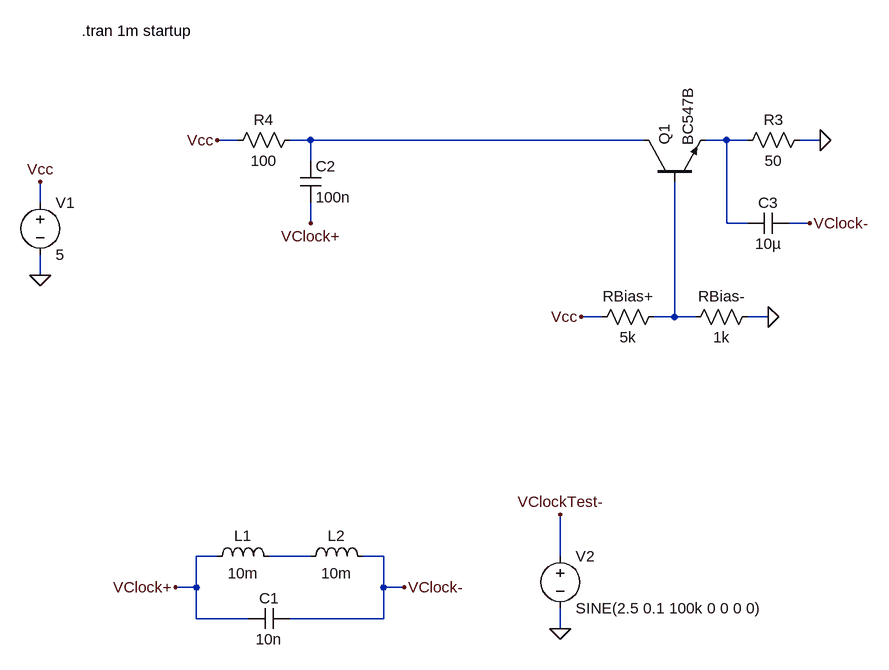
[diagram p0: schematic amplifier_test2.asc]
amplifier_test2.asc, the LTspice schematic file:
Version 4
SHEET 1 880 912
WIRE -224 128 -256 128
WIRE -112 128 -144 128
WIRE 400 128 -112 128
WIRE 528 128 496 128
WIRE 560 128 528 128
WIRE 672 128 640 128
WIRE -112 160 -112 128
WIRE -528 224 -528 192
WIRE -112 256 -112 224
WIRE 528 256 528 128
WIRE 560 256 528 256
WIRE 656 256 624 256
WIRE -528 336 -528 304
WIRE 336 400 304 400
WIRE 448 400 448 192
WIRE 448 400 416 400
WIRE 480 400 448 400
WIRE 592 400 560 400
WIRE -256 768 -288 768
WIRE -112 768 -176 768
WIRE 0 768 -32 768
WIRE 272 768 272 704
WIRE -288 816 -288 768
WIRE -288 816 -320 816
WIRE 0 816 0 768
WIRE 32 816 0 816
WIRE -288 864 -288 816
WIRE -208 864 -288 864
WIRE 0 864 0 816
WIRE 0 864 -144 864
WIRE 272 880 272 848
FLAG -528 336 0
FLAG -528 192 Vcc
FLAG -256 128 Vcc
FLAG 304 400 Vcc
FLAG 672 128 0
FLAG 592 400 0
FLAG 32 816 VClock-
FLAG -320 816 VClock+
FLAG 656 256 VClock-
FLAG -112 256 VClock+
FLAG 272 880 0
FLAG 272 704 VClockTest-
SYMBOL npn 400 192 R270
SYMATTR InstName Q1
SYMATTR Value BC547B
SYMBOL cap -208 880 R270
WINDOW 0 32 32 VTop 2
WINDOW 3 0 32 VBottom 2
SYMATTR InstName C1
SYMATTR Value 10n
SYMBOL ind -272 784 R270
WINDOW 0 32 56 VTop 2
WINDOW 3 5 56 VBottom 2
SYMATTR InstName L1
SYMATTR Value 10m
SYMBOL ind -128 784 R270
WINDOW 0 32 56 VTop 2
WINDOW 3 5 56 VBottom 2
SYMATTR InstName L2
SYMATTR Value 10m
SYMBOL cap 624 240 R90
WINDOW 0 0 32 VBottom 2
WINDOW 3 32 32 VTop 2
SYMATTR InstName C3
SYMATTR Value 10µ
SYMBOL res 320 416 R270
WINDOW 0 32 56 VTop 2
WINDOW 3 0 56 VBottom 2
SYMATTR InstName RBias+
SYMATTR Value 5k
SYMBOL res 464 416 R270
WINDOW 0 32 56 VTop 2
WINDOW 3 0 56 VBottom 2
SYMATTR InstName RBias-
SYMATTR Value 1k
SYMBOL res 544 144 R270
WINDOW 0 32 56 VTop 2
WINDOW 3 0 56 VBottom 2
SYMATTR InstName R3
SYMATTR Value 50
SYMBOL res -240 144 R270
WINDOW 0 32 56 VTop 2
WINDOW 3 0 56 VBottom 2
SYMATTR InstName R4
SYMATTR Value 100
SYMBOL voltage -528 208 R0
WINDOW 123 0 0 Left 0
WINDOW 39 0 0 Left 0
SYMATTR InstName V1
SYMATTR Value 5
SYMBOL voltage 272 752 R0
WINDOW 123 0 0 Left 0
WINDOW 39 0 0 Left 0
SYMATTR InstName V2
SYMATTR Value SINE(2.5 0.1 100k 0 0 0 0)
SYMBOL cap -128 160 R0
SYMATTR InstName C2
SYMATTR Value 100n
TEXT -464 -40 Left 2 !.tran 1m startup

The netlist it stands for:
* amplifier_test2.asc
Q1 N001 N003 N002 0 BC547B
C1 VClock+ VClock- 10n
L1 VClock+ N004 10m
L2 N004 VClock- 10m
C3 VClock- N002 10µ
RBias+ Vcc N003 5k
RBias- N003 0 1k
R3 N002 0 50
R4 Vcc N001 100
V1 Vcc 0 5
V2 VClockTest- 0 SINE(2.5 0.1 100k 0 0 0 0)
C2 N001 VClock+ 100n
.model NPN NPN
.model PNP PNP
.lib standard.bjt
.tran 1m startup
.backanno
.end